# Altium schematic sheet 5V_Isolator.SchDoc
size A
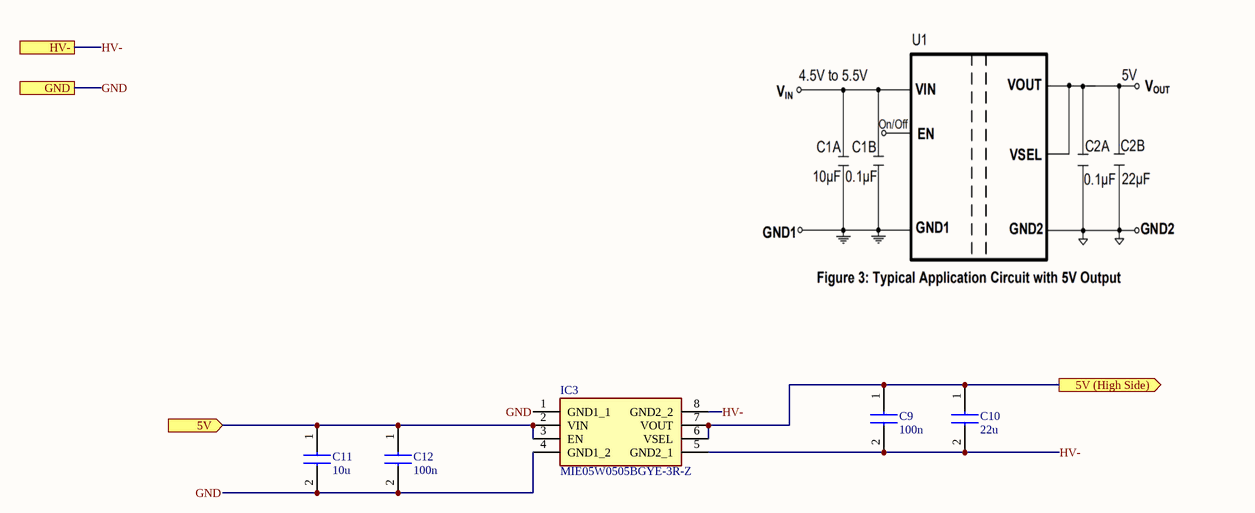
[diagram p0: 5V_Isolator.SchDoc]

## Parts
C9  100n  [CAPC2012X147N]
C10  22u  [CAPC2012X145N]
C11  10u  [GRM21BR60J226ME39L]
C12  100n  [CAPC2012X147N]
IC3  MIE05W0505BGYE-3R-Z  [SOIC127P1030X265-8N]

## Ports
5V (High Side) (out), 5V (in), GND, HV-

## Nets
5V: C11.1 C12.1 IC3.2(VIN) IC3.3(EN) ; port 5V
5V (High Side): C9.1 C10.1 IC3.6(VSEL) IC3.7(VOUT) ; port 5V (High Side)
GND: C11.2 C12.2 IC3.1(GND1_1) IC3.4(GND1_2) ; port GND
HV-: C9.2 C10.2 IC3.5(GND2_1) IC3.8(GND2_2) ; port HV-

## Library data of the parts
C9 C12 = KGF21BR71H104KT: Capacitor; Manufacturer_Name: Kyocera AVX; Datasheet Link: https://www.mouser.fr/datasheet/2/40/KGF-3223650.pdf; Height: 1.47mm; Manufacturer_Part_Number: KGF21BR71H104KT; Mouser Part Number: 581-KGF21BR71H104KT; Mouser Price/Stock: https://www.mouser.co.uk/ProductDetail/KYOCERA-AVX/KGF21BR71H104KT?qs=Jm2GQyTW%2FbjYyKCvVWAEOw%3D%3D; Arrow Part Number: KGF21BR71H104KT; Arrow Price/Stock: https://www.arrow.com/en/products/kgf21br71h104kt/avx?utm_currency=USD&region=nac
C10 = GXT21BR61C226ME13L: Capacitor; Manufacturer_Name: Murata Electronics; Datasheet Link: https://www.murata.com/en-global/products/productdetail?partno=GXT21BR61C226ME13%23; Height: 1.45mm; Manufacturer_Part_Number: GXT21BR61C226ME13L
C11 = GRM21BR61H106KE43L: Capacitor; Manufacturer_Name: Murata Electronics; Datasheet Link: https://search.murata.co.jp/Ceramy/image/img/A01X/G101/ENG/GRM21BR61H106KE43-01A.pdf; Height: 1.45mm; Manufacturer_Part_Number: GRM21BR61H106KE43L; Mouser Part Number: 81-GRM21BR61H106KE3L; Mouser Price/Stock: https://www.mouser.co.uk/ProductDetail/Murata-Electronics/GRM21BR61H106KE43L?qs=lYGu3FyN48cBZlIduWKclg%3D%3D; Arrow Part Number: GRM21BR61H106KE43L; Arrow Price/Stock: https://www.arrow.com/en/products/grm21br61h106ke43l/murata-manufacturing?utm_currency=USD&region=europe
IC3 = MIE05W0505BGYE-3R-Z: Integrated Circuit; Manufacturer_Name: Monolithic Power Systems (MPS); Datasheet Link: https://www.monolithicpower.com/en/documentview/productdocument/index/version/2/document_type/Datasheet/lang/en/sku/MIE05W0505BGYE/document_id/11798/; Height: 2.65mm; Manufacturer_Part_Number: MIE05W0505BGYE-3R-Z